# Altium schematic sheet 反向放大器.SchDoc
size A4
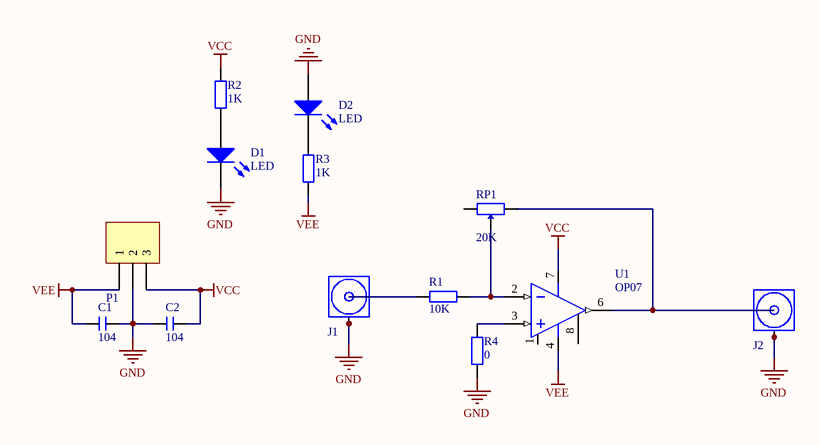
[diagram p0: 反向放大器.SchDoc]

## Parts
C1  104  [C 0805]
C2  104  [C 0805]
D1  LED  [LED_0805]
D2  LED  [LED_0805]
J1  COAX  [MCX5.08-5-H]  (value not drawn)
J2  COAX  [MCX5.08-5-H]  (value not drawn)
P1  Header 3  [HDR3X1_B2]  (value not drawn)
R1  10K  [R 0805]
R2  1K  [R 0805]
R3  1K  [R 0805]
R4  0  [R 0603]
RP1  20K  [3296W]
U1  OP07  [SO8_L]

## Nets
GND: C1.2 C2.1 D1.2(K) D2.1(A) J1.2(GND) J1.3(GND) J1.4(GND) J1.5(GND) J2.2(GND) J2.3(GND) J2.4(GND) J2.5(GND) P1.2 R4.1
VCC: C2.2 P1.3 R2.2 U1.7(V+)
VEE: C1.1 P1.1 R3.1 U1.4(V-)
NetD1_1: D1.1(A) R2.1
NetD2_2: D2.2(K) R3.2
NetJ1_1: J1.1(Signal) R1.1
NetJ2_1: J2.1(Signal) RP1.1 U1.6(OUT)
NetR1_2: R1.2 RP1.2 U1.2(IN-)
NetR4_2: R4.2 U1.3(IN+)

Not connected (* = marked no-connect by the designer): RP1 3; U1 1(OFFSET_N1) 8(OFFSET_N2)

## Library data of the parts
C1 C2 = C: 无极性贴片电容; 版权归属: 源创客; BOM名称: 无极性贴片电容; 学习资源: www.ooocke.com
D1 D2 = LED: 发光二极管; Published: 8-Jun-2000; LatestRevisionDate: 08-Jul-2005; LatestRevisionNote: Mech Layer 1 removed.; PackageReference: LED; Publisher: Altium Limited
P1 = Header 3: 接插件; LatestRevisionDate: 17-Jul-2002; LatestRevisionNote: Re-released for DXP Platform.; Publisher: Altium Limited
R1-R4 = R: 贴片电阻; 版权归属: 源创客; BOM名称: 贴片电阻; 学习资源: www.ooocke.com
RP1 = RP-ID: 插件单联电位器; BOM名称: 插件电位器; 版权归属: 源创客; 学习资源: www.ooocke.com
U1 = OP07: Precision Operational Amplifiers